# Altium schematic sheet Main.SchDoc
size A
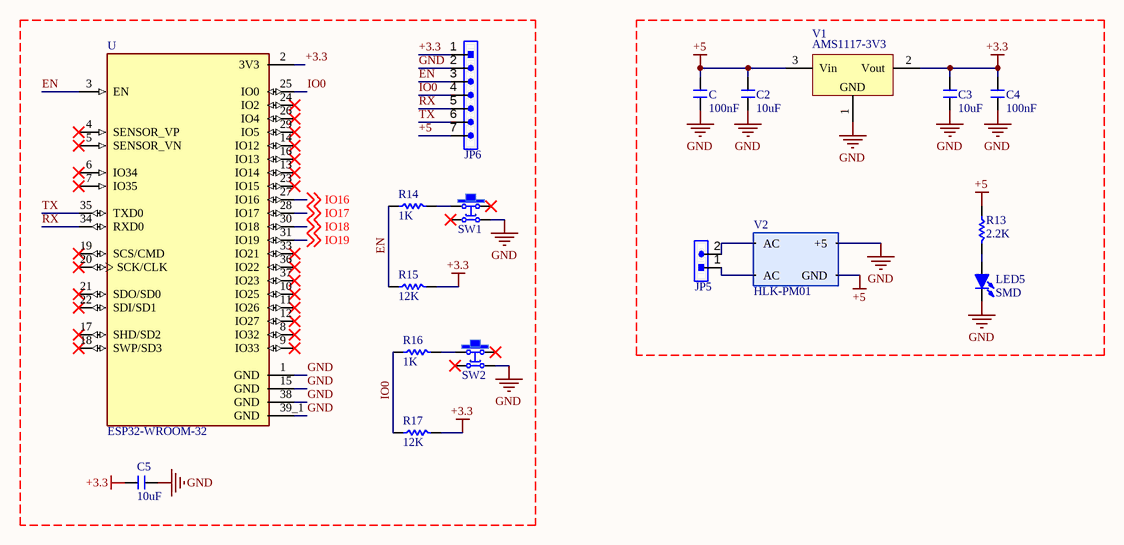
[diagram p0: Main.SchDoc]

## Parts
C  100nF  [C 0805]
C2  10uF  [C 0805]
C3  10uF  [C 0805]
C4  100nF  [C 0805]
C5  10uF  [C 0805]
JP5  HDR-1X2  [KF2EDGK-2P]  (value not drawn)
JP6  HDR-1X7  [HDR-1X7]  (value not drawn)
LED5  SMD  [LED 0805R]
R13  2.2K  [R 0805]
R14  1K  [R 0805]
R15  12K  [R 0805]
R16  1K  [R 0805]
R17  12K  [R 0805]
SW1  Reset Key  [TSW SMD-6*6*4.3]  (value not drawn)
SW2  Reset Key  [TSW SMD-6*6*4.3]  (value not drawn)
U  ESP32-WROOM-32  [MODULE_ESP32-WROOM-32]
V1  AMS1117-3V3  [SOT223_L]
V2  HLK-PM01  [HLKPM01]

## Nets
+3.3: C3.2 C4.2 C5.2 JP6.1 R15.2 R17.2 U.2(3V3) V1.2(Vout)
+5: C.2 C2.2 JP6.7 R13.1 V1.3(Vin) V2.4(GND)
GND: C.1 C2.1 C3.1 C4.1 C5.1 JP6.2 LED5.2(K) SW1.3 SW2.3 U.1(GND) U.15(GND) U.38(GND) U.39_1(GND) V1.1(GND) V2.3(+5)
EN: JP6.3 R14.1 R15.1 U.3(EN)
IO0: JP6.4 R16.1 R17.1 U.25(IO0)
IO16: U.27(IO16) ; off-sheet IO16
IO17: U.28(IO17) ; off-sheet IO17
IO18: U.30(IO18) ; off-sheet IO18
IO19: U.31(IO19) ; off-sheet IO19
RX: JP6.5 U.34(RXD0)
TX: JP6.6 U.35(TXD0)
NetJP5_1: JP5.1 V2.2(AC)
NetJP5_2: JP5.2 V2.1(AC)
NetLED5_1: LED5.1(A) R13.2
NetR14_2: R14.2 SW1.1
NetR16_2: R16.2 SW2.1

Not connected (* = marked no-connect by the designer): SW1 2* 4*; SW2 2* 4*; U 4(SENSOR_VP)* 5(SENSOR_VN)* 6(IO34)* 7(IO35)* 8(IO32)* 9(IO33)* 10(IO25)* 11(IO26)* 12(IO27)* 13(IO14)* 14(IO12)* 16(IO13)* 17(SHD/SD2)* 18(SWP/SD3)* 19(SCS/CMD)* 20(SCK/CLK)* 21(SDO/SD0)* 22(SDI/SD1)* 23(IO15)* 24(IO2)* 26(IO4)* 29(IO5)* 33(IO21)* 36(IO22)* 37(IO23)*

## Library data of the parts
C C2-C5 = C: Non-polar patch capacitor; BOM名称: 无极性贴片电容; 版权归属: 源创客; 学习资源: www.ooocke.com
JP5 = Header 2: 2P Connector; BOM名称: 2P接插件; 版权归属: 源创客; 学习资源: www.ooocke.com
JP6 = Header 7: 7P Connector; BOM名称: 7P接插件; 版权归属: 源创客; 学习资源: www.ooocke.com
LED5 = LED-SMD: RED LED; BOM名称: 贴片LED; 版权归属: 源创客; 学习资源: www.ooocke.com
R13-R17 = R: Chip resistor; 版权归属: 源创客; BOM名称: Chip resistor; 学习资源: www.ooocke.com
SW1 SW2 = TSW SMD-6x6: Patch 6x6 tact switch; BOM名称: 贴片6x6轻触开关; 版权归属: 源创客; 学习资源: www.ooocke.com
U = ESP32-WROOM-32: Bluetooth, WiFi Transceiver Module 2.4GHz ~ 2.5GHz Surface Mount; MF: Espressif Systems; Package: Module Espressif Systems; Digi-Key_Part_Number: 1904-1010-1-ND; Digi-Key_Purchase_URL: https://www.digikey.com/product-detail/en/espressif-systems/ESP32-WROOM-32/1904-1010-1-ND/8544305?utm_source=snapeda&utm_medium=aggregator&utm_campaign=symbol; Value: *; MP: ESP32-WROOM-32; SnapEDA_Link: https://www.snapeda.com/parts/ESP32-WROOM-32/Espressif%20Systems/view-part/2753322/?ref=snap
V1 = AMS1117: Three-terminal regulator chip; BOM名称: 稳压芯片; 版权归属: 源创客; 学习资源: www.ooocke.com
V2 = HLK-PM01: <b>Ultra-compact power module</b><p> Source: <a href="https://datasheet.lcsc.com/szlcsc/1906201102_HI-LINK-HLK-PM03_C209904.pdf"> Datasheet </a>; Package: Package Analog Devices; MF: Hi-link; Availability: Unavailable; Value: *; MP: hlk-pm01; Price: None; SnapEDA_Link: https://www.snapeda.com/parts/hlk-pm01/Hi-link/view-part/2875605/?ref=snap